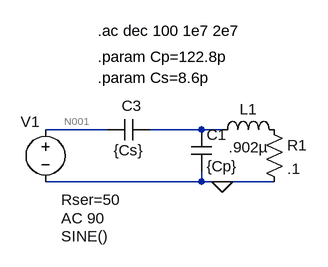
[diagram p0: schematic current divider.asc]
current divider.asc, the LTspice schematic file:
Version 4
SHEET 1 880 680
WIRE 112 128 16 128
WIRE 256 128 176 128
WIRE 288 128 256 128
WIRE 256 208 256 192
WIRE 256 208 16 208
WIRE 288 208 256 208
WIRE 368 208 288 208
FLAG 288 208 0
SYMBOL cap 240 128 R0
SYMATTR InstName C1
SYMATTR Value {Cp}
SYMBOL ind 272 144 R270
WINDOW 0 32 56 VTop 2
WINDOW 3 5 56 VBottom 2
SYMATTR InstName L1
SYMATTR Value .902µ
SYMBOL res 352 112 R0
SYMATTR InstName R1
SYMATTR Value .1
SYMBOL voltage 16 112 R0
WINDOW 0 -38 4 Left 2
WINDOW 123 24 152 Left 2
WINDOW 39 24 124 Left 2
WINDOW 3 24 180 Left 2
SYMATTR InstName V1
SYMATTR Value2 AC 90
SYMATTR SpiceLine Rser=50
SYMATTR Value SINE()
SYMBOL cap 176 112 R90
WINDOW 0 -5 27 VBottom 2
WINDOW 3 32 32 VTop 2
SYMATTR InstName C3
SYMATTR Value {Cs}
TEXT 96 -24 Left 2 !.ac dec 100 1e7 2e7
TEXT 96 48 Left 2 !.param Cs=8.6p
TEXT 96 16 Left 2 !.param Cp=122.8p

The netlist it stands for:
* current divider.asc
C1 N002 0 {Cp}
L1 N002 P001 .902µ
R1 P001 0 .1
V1 N001 0 SINE() AC 90 Rser=50
C3 N002 N001 {Cs}
.ac dec 100 1e7 2e7
.param Cs=8.6p
.param Cp=122.8p
.backanno
.end

* Results of the author's LTspice run, read from the files saved beside the schematic
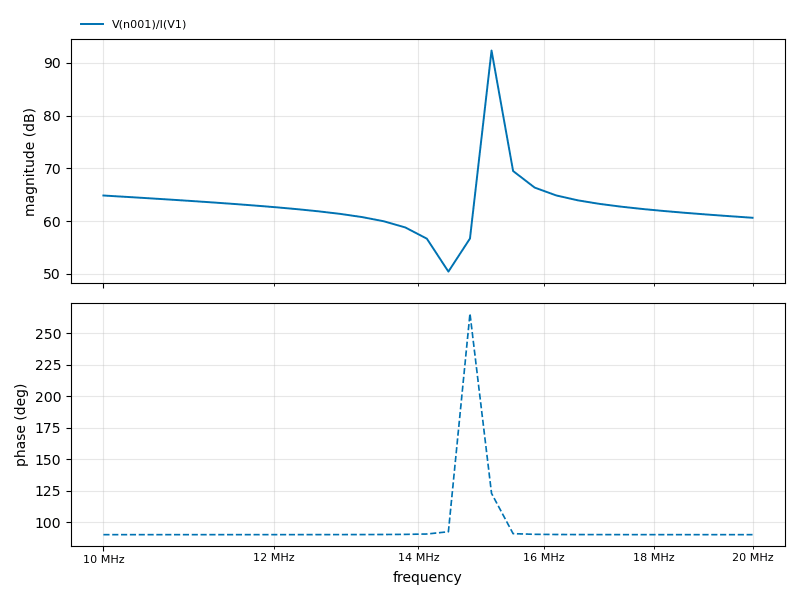
[diagram p1: AC Analysis of current divider.asc, plotted from the saved traces]
* AC Analysis, 1 run:
*   V(n001)/I(V1): 64.86 dB at 10 MHz, 60.64 dB at 20 MHz, peak 92.36 dB at 15.14 MHz, 3 dB below the peak at 15.11 MHz and 15.18 MHz